# EAGLE design phaser (EAGLE 5.12)
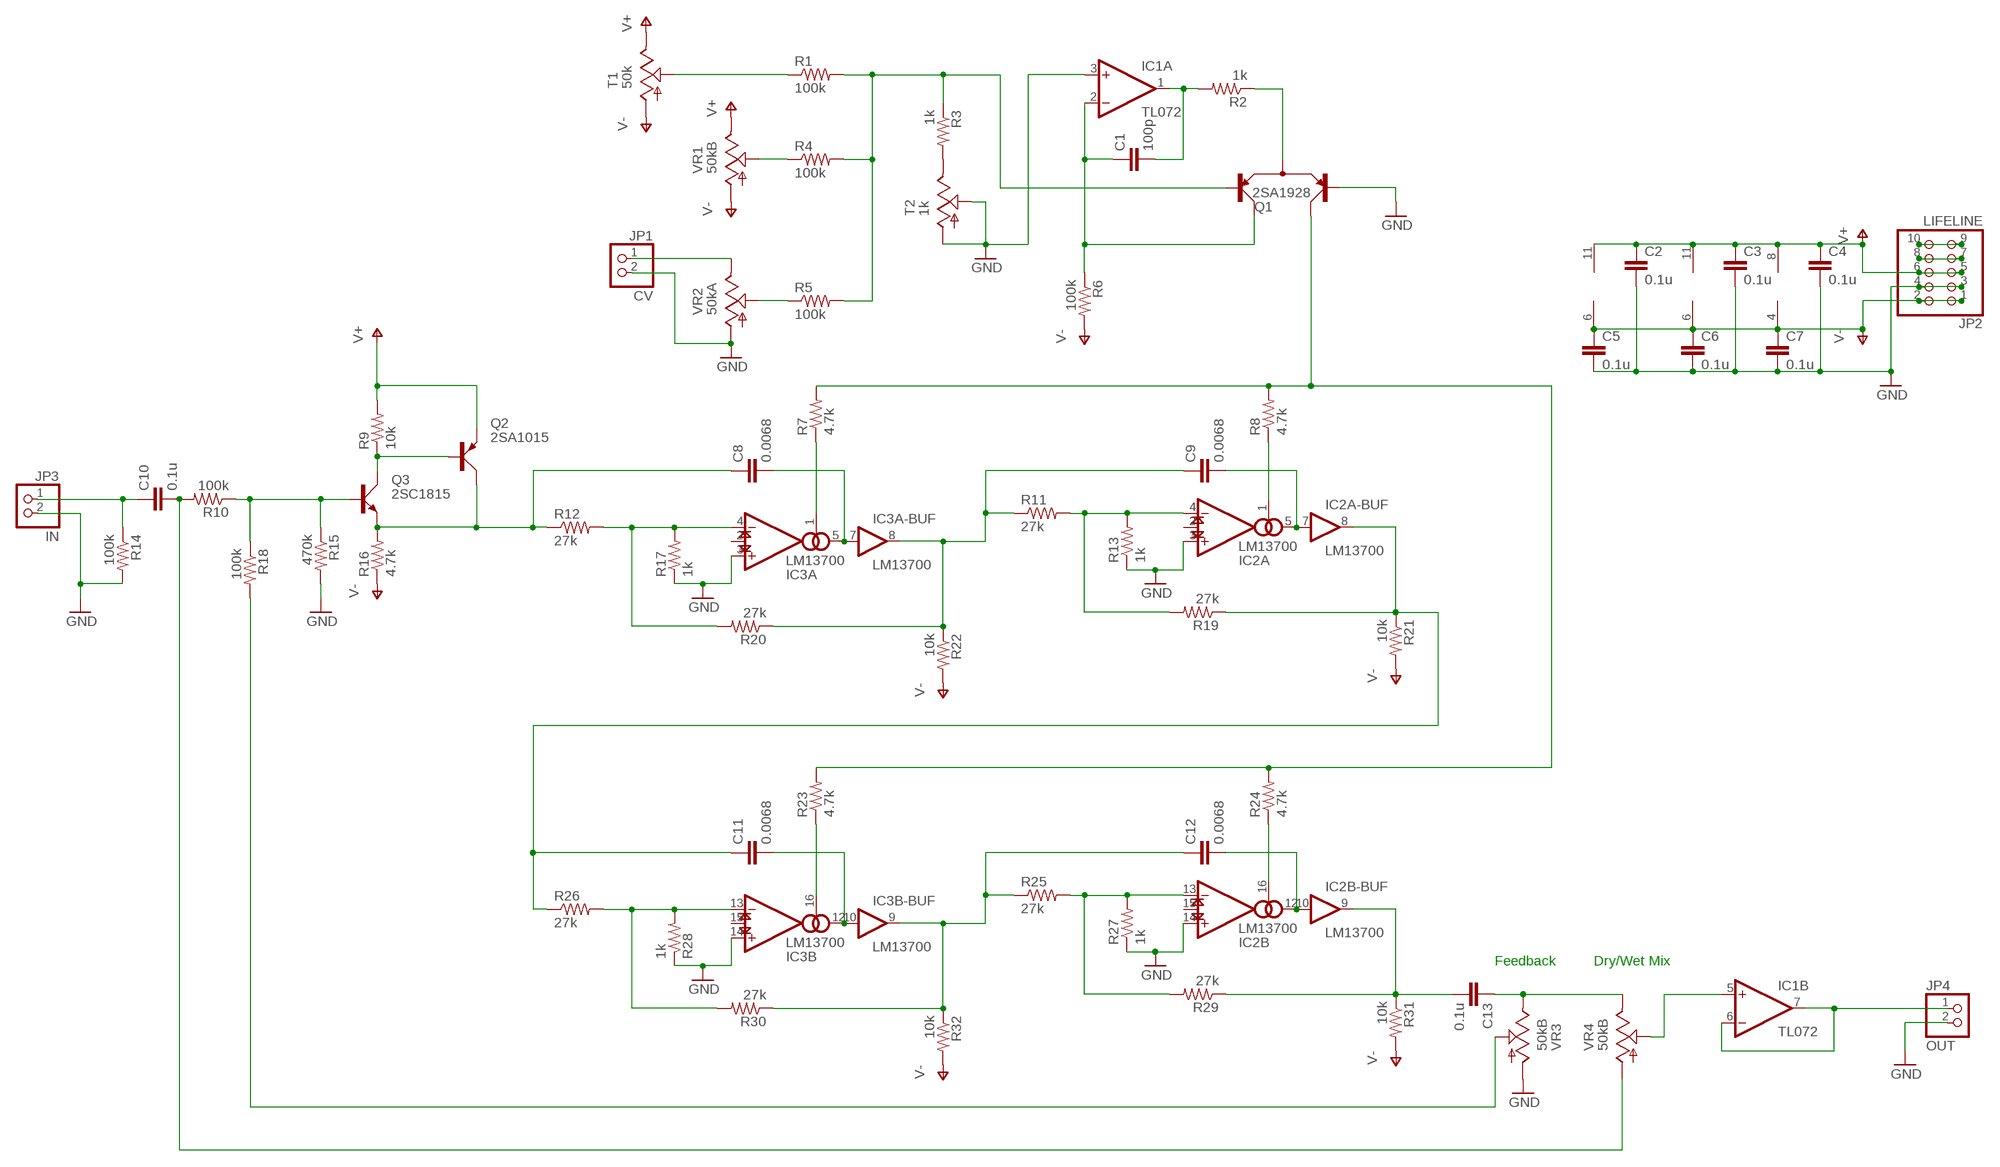
[diagram p0: schematic, sheet 1]

## Parts
C1  100p  C-EU025-025X050  [C025-025X050]
C2  0.1u  C-EU050-025X075  [C050-025X075]
C3  0.1u  C-EU050-025X075  [C050-025X075]
C4  0.1u  C-EU050-025X075  [C050-025X075]
C5  0.1u  C-EU050-025X075  [C050-025X075]
C6  0.1u  C-EU050-025X075  [C050-025X075]
C7  0.1u  C-EU050-025X075  [C050-025X075]
C8  0.0068  C-EU050-024X044  [C050-024X044]
C9  0.0068  C-EU050-024X044  [C050-024X044]
C10  0.1u  C-EU050-024X044  [C050-024X044]
C11  0.0068  C-EU050-024X044  [C050-024X044]
C12  0.0068  C-EU050-024X044  [C050-024X044]
C13  0.1u  C-EU050-024X044  [C050-024X044]
IC1  TL072  TL072P  [DIL08]
IC2  LM13700  LM13700R  [SO16FLIP]
IC3  LM13700  LM13700R  [SO16FLIP]
JP1  CV  PINHD-1X2  [1X02]
JP2  LIFELINE  PINHD-2X5  [2X05]
JP3  IN  PINHD-1X2  [1X02]
JP4  OUT  PINHD-1X2  [1X02]
Q1  2SA1928  [SIP5P]
Q2  2SA1015  [TO92-LINE]
Q3  2SC1815  2SC1815"  [TO92-LINE]
R1  100k  R-US_0204/5_SF  [0204/5_SF]
R2  1k  R-US_0204/5_SF  [0204/5_SF]
R3  1k  R-US_0204/5_SF  [0204/5_SF]
R4  100k  R-US_0204/5_SF  [0204/5_SF]
R5  100k  R-US_0204/5_SF  [0204/5_SF]
R6  100k  R-US_0204/5_SF  [0204/5_SF]
R7  4.7k  R-US_0204/5_SF  [0204/5_SF]
R8  4.7k  R-US_0204/5_SF  [0204/5_SF]
R9  10k  R-US_0204/5_SF  [0204/5_SF]
R10  100k  R-US_0204/5_SF  [0204/5_SF]
R11  27k  R-US_0204/5_SF  [0204/5_SF]
R12  27k  R-US_0204/5_SF  [0204/5_SF]
R13  1k  R-US_0204/5_SF  [0204/5_SF]
R14  100k  R-US_0204/5_SF  [0204/5_SF]
R15  470k  R-US_0204/5_SF  [0204/5_SF]
R16  4.7k  R-US_0204/5_SF  [0204/5_SF]
R17  1k  R-US_0204/5_SF  [0204/5_SF]
R18  100k  R-US_0204/5_SF  [0204/5_SF]
R19  27k  R-US_0204/5_SF  [0204/5_SF]
R20  27k  R-US_0204/5_SF  [0204/5_SF]
R21  10k  R-US_0204/5_SF  [0204/5_SF]
R22  10k  R-US_0204/5_SF  [0204/5_SF]
R23  4.7k  R-US_0204/5_SF  [0204/5_SF]
R24  4.7k  R-US_0204/5_SF  [0204/5_SF]
R25  27k  R-US_0204/5_SF  [0204/5_SF]
R26  27k  R-US_0204/5_SF  [0204/5_SF]
R27  1k  R-US_0204/5_SF  [0204/5_SF]
R28  1k  R-US_0204/5_SF  [0204/5_SF]
R29  27k  R-US_0204/5_SF  [0204/5_SF]
R30  27k  R-US_0204/5_SF  [0204/5_SF]
R31  10k  R-US_0204/5_SF  [0204/5_SF]
R32  10k  R-US_0204/5_SF  [0204/5_SF]
T1  50k  TRIM_US-B25P  [B25P]
T2  1k  TRIM_US-B25P  [B25P]
VR1  50kB  POT  [EVUE2]
VR2  50kA  POT  [EVUE2]
VR3  50kB  POT  [EVUE2]
VR4  50kB  POT  [EVUE2]

## Nets
GND: C2.2 C3.2 C4.2 C5.2 C6.2 C7.2 IC1.3(A:+IN) IC2.3(A:+IN) IC2.14(B:+IN) IC3.3(A:+IN) IC3.14(B:+IN) JP1.2 JP2.3 JP2.4 JP3.2 JP4.2 Q1.P$5(B2) R13.1 R14.2 R15.2 R17.1 R27.1 R28.1 T2.A T2.S VR2.A VR3.A
N$1: IC3.4(A:-IN) R12.2 R17.2 R20.2
N$2: IC2.4(A:-IN) R11.2 R13.2 R19.2
N$3: C9.1 IC3.8(A-BUF:OUT) R11.1 R20.1 R22.1
N$4: C8.2 IC3.5(A:OUT) IC3.7(A-BUF:IN)
N$5: Q2.1(B) Q3.2(C) R9.1
N$6: IC3.13(B:-IN) R26.2 R28.2 R30.2
N$7: C9.2 IC2.5(A:OUT) IC2.7(A-BUF:IN)
N$8: C12.1 IC3.9(B-BUF:OUT) R25.1 R30.1 R32.1
N$9: C11.2 IC3.10(B-BUF:IN) IC3.12(B:OUT)
N$10: Q1.P$4(C2) R7.2 R8.2 R23.2 R24.2
N$11: IC2.13(B:-IN) R25.2 R27.2 R29.2
N$12: C12.2 IC2.10(B-BUF:IN) IC2.12(B:OUT)
N$13: C13.2 IC2.9(B-BUF:OUT) R29.1 R31.1
N$14: IC3.1(A:IABC) R7.1
N$15: IC2.1(A:IABC) R8.1
N$16: IC3.16(B:IABC) R23.1
N$17: IC1.6(B:-IN) IC1.7(B:OUT) JP4.1
N$18: IC2.16(B:IABC) R24.1
N$19: R18.2 VR3.S
N$20: C8.1 Q2.2(C) Q3.3(E) R12.1 R16.2
N$21: R1.1 T1.S
N$22: C11.1 IC2.8(A-BUF:OUT) R19.1 R21.1 R26.1
N$23: C1.2 IC1.1(A:OUT) R2.2
N$24: Q1.P$3(E1) R2.1
N$25: C1.1 IC1.2(A:-IN) Q1.P$2(C1) R6.1
N$26: Q3.1(B) R10.1 R15.1 R18.1
N$27: Q1.P$1(B1) R1.2 R3.1 R4.2 R5.2
N$28: C10.2 R10.2 VR4.A
N$29: R3.2 T2.E
N$30: R5.1 VR2.S
N$31: R4.1 VR1.S
N$32: JP1.1 VR2.E
N$34: C13.1 VR3.E VR4.E
N$35: IC1.5(B:+IN) VR4.S
N$36: C10.1 JP3.1 R14.1
N$37: JP2.7 JP2.8
N$38: JP2.9 JP2.10
V+: C2.1 C3.1 C4.1 IC1.8(P:V+) IC2.11(V+) IC3.11(V+) JP2.5 JP2.6 Q2.3(E) R9.2 T1.E VR1.E
V-: C5.1 C6.1 C7.1 IC1.4(P:V-) IC2.6(V-) IC3.6(V-) JP2.1 JP2.2 R6.2 R16.1 R21.2 R22.2 R31.2 R32.2 T1.A VR1.A
Unconnected: IC2.2(A:DIODEBIAS) IC2.15(B:DIODEBIAS) IC3.2(A:DIODEBIAS) IC3.15(B:DIODEBIAS)

## Notes on the sheet
- Feedback | Dry/Wet Mix

## Library data of the parts
C1-C13 = akihabara:C-EU: CAPACITOR, European symbol
IC1 = linear:TL072: OP AMP
IC2 IC3 = akihabara:LM13700
JP1 JP3 JP4 = pinhead:PINHD-1X2: PIN HEADER
JP2 = pinhead:PINHD-2X5: PIN HEADER
Q1 = transistor-small-signal:2SA1928: 2SA1928 dual PNP transistor
Q2 = akihabara:2SA1015: 2SA1015 Complementary to 2SC1815. Package ECB
Q3 = akihabara:2SC1815: 2SC1815 Audio frequency general purpose amplifier. Package ECB. Complementary to 2SA1015
R1-R32 = akihabara:R-US_: RESISTOR, American symbol
T1 T2 = akihabara:TRIM_US-: POTENTIOMETER
VR1-VR4 = akihabara:POT

## Board
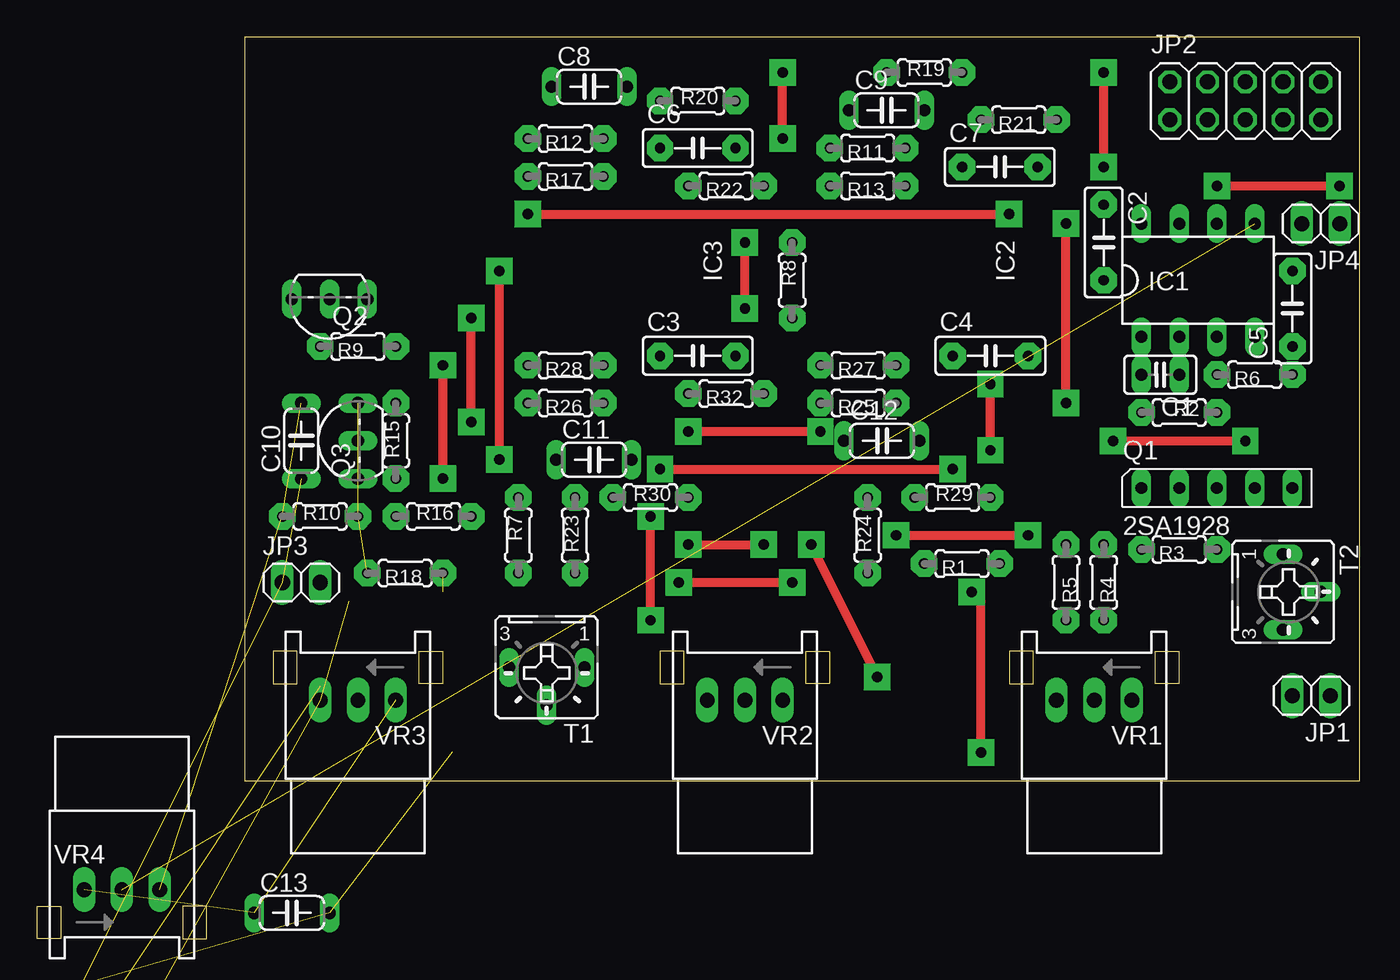
[diagram p1: board, top side]
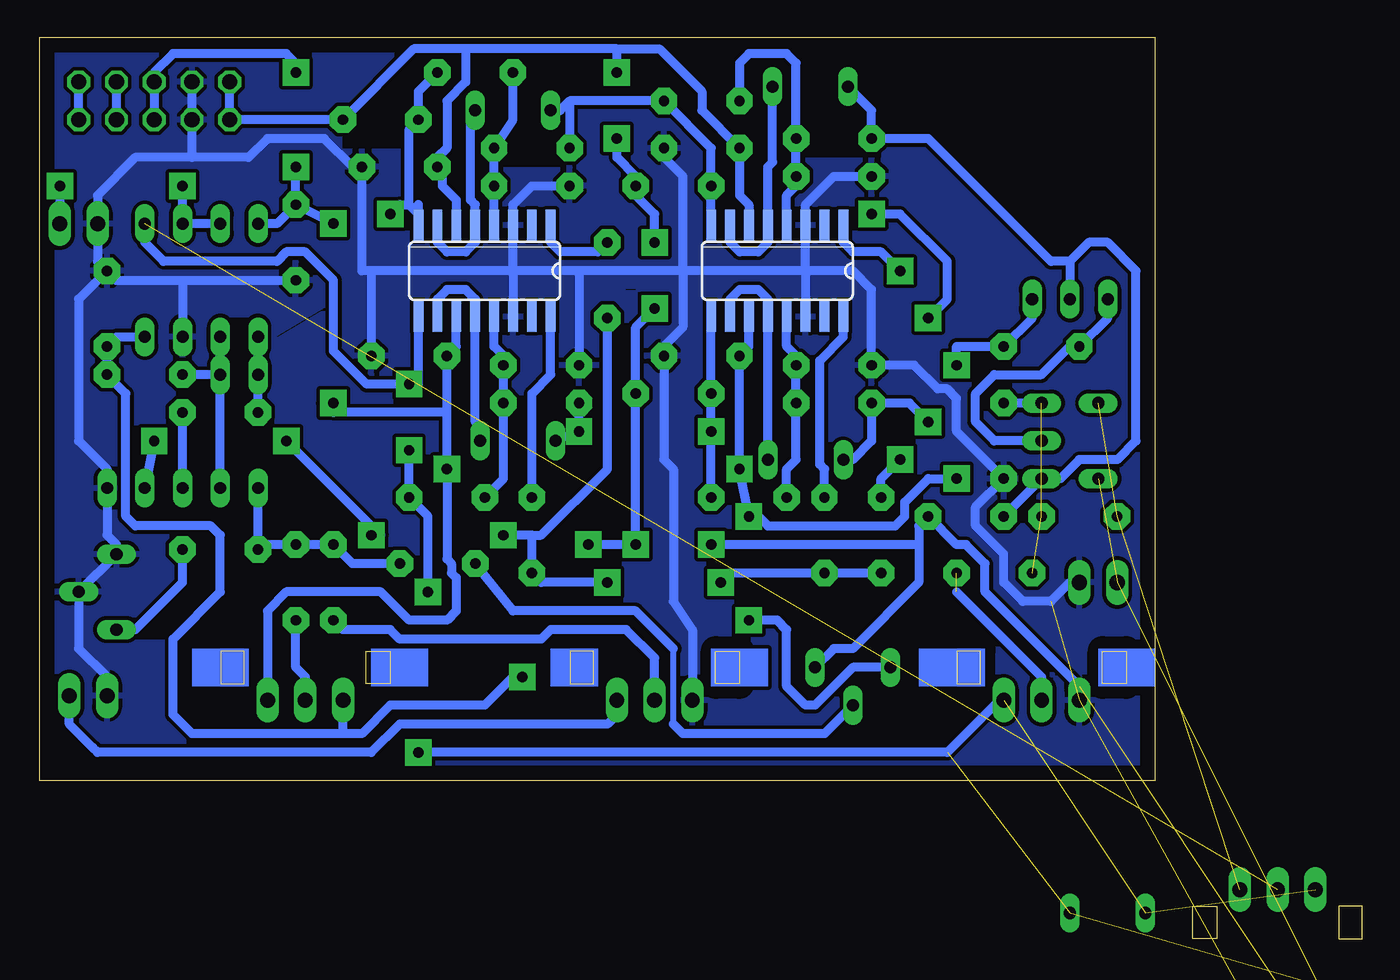
[diagram p2: board, bottom side, seen from below]

Size 75 x 50 mm. Coordinates in mm from the lower left corner, seen from the top.
Outline: 0,0 75,0 75,50 0,50 0,0
Copper layers (1*16): Top 0.035mm / dielectric 1.5mm / Bottom 0.035mm
Design rules "first": minimum track width 10mil, minimum drill 24mil, track to track 10mil, track to pad 10mil, pad to pad 10mil, via to via 10mil, smd to smd 8mil, copper to edge 40mil, drill to drill 16mil, minimum pad ring 10mil, minimum via ring 8mil, stop-mask expansion 4mil, vias tented up to drill 0mil, thermal gap 10mil
bRestrict: 8 lines

### Footprints (pad centres in the part's own frame; a part is rotated, then mirrored left to right if it is on the bottom)
C025-025X050 = drill 0.813 long: 1 -1.27,0; 2 1.27,0
C050-025X075 = drill 0.7 pad 1.778 octagon: 1 -2.54,0; 2 2.54,0
C050-024X044 = drill 0.813 long: 1 -2.54,0; 2 2.54,0
DIL08 = drill 0.813 long: 1 -3.81,-3.81; 2 -1.27,-3.81; 3 1.27,-3.81; 4 3.81,-3.81; 5 3.81,3.81; 6 1.27,3.81; 7 -1.27,3.81; 8 -3.81,3.81
SO16FLIP = smd 0.66 x 2.032 bottom: 1 4.445,-3.073; 2 3.175,-3.073; 3 1.905,-3.073; 4 0.635,-3.073; 5 -0.635,-3.073; 6 -1.905,-3.073; 7 -3.175,-3.073; 8 -4.445,-3.073; 9 -4.445,3.073; 10 -3.175,3.073; 11 -1.905,3.073; 12 -0.635,3.073; 13 0.635,3.073; 14 1.905,3.073; 15 3.175,3.073; 16 4.445,3.073
1X02 = drill 1.016 long: 1 -1.27,0; 2 1.27,0
2X05 = drill 1.016 octagon: 1 -5.08,-1.27; 2 -5.08,1.27; 3 -2.54,-1.27; 4 -2.54,1.27; 5 0,-1.27; 6 0,1.27; 7 2.54,-1.27; 8 2.54,1.27; 9 5.08,-1.27; 10 5.08,1.27
SIP5P = drill 0.8 long: P$1 -5.08,0; P$2 -2.54,0; P$3 0,0; P$4 2.54,0; P$5 5.08,0
TO92-LINE = drill 0.813 long: 1 2.54,0; 2 0,0; 3 -2.54,0
0204/5_SF = drill 0.7 pad 1.778 octagon: 1 -2.54,0; 2 2.54,0
B25P = drill 0.813 long: A -2.54,0; E 2.54,0; S 0,2.54
EVUE2 = drill 1 long: A 2.54,2.2; E -2.54,2.2; S 0,2.2

### Placement (x,y rotation side)
C1  61.59,27.3 180 top
C2  57.78,36.2 270 top
C3  30.48,28.57 0 top
C4  50.16,28.57 0 top
C5  70.48,31.75 90 top
C6  30.48,42.55 0 top
C7  50.8,41.27 0 top
C8  23.18,46.67 0 top
C9  43.18,45.09 0 top
C10  3.81,22.86 90 top
C11  23.5,21.59 0 top
C12  42.86,22.86 0 top
C13  3.17,-8.89 0 top  (outside the outline)
IC1  64.14,33.66 0 top
IC2  45.09,34.29 180 top
IC3  25.4,34.29 180 top
JP1  71.75,5.71 180 top
JP2  67.31,45.72 0 top
JP3  3.81,13.34 0 top
JP4  72.39,37.47 180 top
Q1  65.41,19.68 0 top
Q2  5.71,32.38 180 top
Q3  7.62,22.86 90 top
R1  48.26,14.61 0 top
R2  62.87,24.77 180 top
R3  62.87,15.56 0 top
R4  57.78,13.34 90 top
R5  55.24,13.34 90 top
R6  67.94,27.3 0 top
R7  18.41,16.51 270 top
R8  36.83,33.66 270 top
R9  7.62,29.21 0 top
R10  5.08,17.78 180 top
R11  41.91,42.55 0 top
R12  21.59,43.18 0 top
R13  41.91,40.01 0 top
R14  -11.43,-19.68 0 top  (outside the outline)
R15  10.16,22.86 270 top
R16  12.7,17.78 180 top
R17  21.59,40.64 0 top
R18  10.79,13.97 0 top
R19  45.72,47.62 180 top
R20  30.48,45.72 180 top
R21  52.07,44.45 0 top
R22  32.38,40.01 0 top
R23  22.23,16.51 270 top
R24  41.91,16.51 270 top
R25  41.27,25.4 0 top
R26  21.59,25.4 0 top
R27  41.27,27.94 0 top
R28  21.59,27.94 0 top
R29  47.62,19.05 180 top
R30  27.3,19.05 180 top
R31  -11.43,-14.61 0 top  (outside the outline)
R32  32.38,26.04 0 top
T1  20.32,7.62 180 top
T2  69.85,12.7 270 top
VR1  57.15,7.62 180 top
VR2  33.66,7.62 180 top
VR3  7.62,7.62 180 top
VR4  -8.26,-9.53 0 top  (outside the outline)

### Tracks (layer width: path | path; a pad name or v marks a point on that pad's centre or on a via)
GND  (2 unrouted)
  Bottom 0.61: 23.5,34.29 IC3.14 | 23.5,34.29 IC3.3 23.5,38.73 21.59,40.64 R17.1 | 23.5,34.29 31.75,34.29 | 31.75,34.29 38.73,34.29 | 38.73,34.29 43.18,34.29 | 43.18,34.29 52.7,34.29 | 52.7,34.29 53.34,34.29 C7.2 53.98,41.27 55.88,43.18 59.69,43.18 60.96,41.91 64.77,41.91 | 43.18,34.29 IC2.3 43.18,38.73 41.91,40.01 R13.1 | 43.18,34.29 IC2.14 | 52.7,34.29 C4.2 | 38.73,34.29 R27.1 | 31.75,34.29 31.75,30.48 33.02,29.21 C3.2 33.02,21.59 32.38,20.95 32.38,12.06 31.11,10.16 VR2.A | C6.2 33.02,41.91 31.75,40.64 31.75,34.29 | 64.77,41.91 JP2.3 JP2.4 | 64.77,41.91 68.58,41.91 71.12,39.37 JP4.2 71.12,34.92 C5.2 | 65.41,33.66 C2.2 | 65.41,33.66 69.85,33.66 C5.2 | 65.41,33.66 IC1.3 | JP1.2 70.48,6.99 72.39,8.89 T2.S T2.A 69.85,15.88 70.48,16.51 Q1.P$5 70.48,20.95 72.39,22.86 72.39,32.38 C5.2 | JP3.2 5.71,13.34 6.99,12.06 8.89,12.06 10.16,13.34 10.16,15.24 12.06,17.14 12.06,18.41 R15.2 13.34,23.5 13.34,25.72 13.97,26.35 14.61,26.35 16.19,27.94 R28.1 19.05,33.02 20.32,34.29 23.5,34.29
  pour Bottom: 0,50.16 75.56,50.16 75.56,-0.64 -0.64,-0.64 -0.64,50.16
N$1
  Bottom 0.61: IC3.4 24.77,39.37 24.13,40.01 R17.2 R12.2 24.13,48.26 24.77,48.9 27.3,48.9 27.94,48.26 R20.2
N$2
  Bottom 0.61: R19.2 43.18,44.45 R11.2 R13.2 IC2.4
N$3
  Bottom 0.61: IC3.8 R22.1 29.84,42.55 R20.1 39.37,45.72 | 39.37,45.72 R11.1 | 39.37,45.72 40.01,45.09 C9.1
N$4
  Bottom 0.61: 28.57,38.1 IC3.7 28.57,36.2 27.94,35.56 26.67,35.56 26.04,36.2 IC3.5 26.04,41.27 25.72,41.59 C8.2
N$5
  Bottom 0.61: Q2.1 3.17,31.11 R9.1 5.71,29.21 7.62,27.3 10.79,27.3 12.06,26.04 12.06,24.13 10.79,22.86 Q3.2
N$6
  Bottom 0.61: R30.2 24.77,20.95 24.13,21.59 R26.2 R28.2 24.13,28.57 24.77,29.21 IC3.13
N$7
  Bottom 0.61: IC2.7 48.26,36.2 47.62,35.56 46.35,35.56 45.72,36.2 IC2.5 45.72,38.73 46.04,39.05 46.04,44.77 C9.2
N$8  (via drill 0.7 pad 1.78)
  Top 0.61: v29.84,23.5 v38.73,23.5
  Bottom 0.61: R30.1 v29.84,23.5 R32.1 IC3.9 | C12.1 v38.73,23.5 R25.1
N$9
  Bottom 0.61: C11.2 IC3.12 26.04,32.38 26.67,33.02 27.94,33.02 28.57,32.38 IC3.10
N$10  (via drill 0.7 pad 1.78)
  Top 0.61: v43.81,16.51 v52.7,16.51 | v58.42,22.86 v67.31,22.86 | v29.21,13.34 v36.83,13.34
  Bottom 0.61: R7.2 R23.2 28.57,13.97 v29.21,13.34 | 41.91,16.51 R24.2 41.27,13.34 v36.83,13.34 | 41.91,16.51 v43.81,16.51 | v52.7,16.51 52.07,16.51 v58.42,22.86 | v67.31,22.86 Q1.P$4 | 41.91,16.51 41.27,16.51 36.83,20.95 R8.2
N$11
  Bottom 0.61: R29.2 43.81,20.32 R25.2 R27.2 43.81,28.57 44.45,29.21 IC2.13
N$12
  Bottom 0.61: C12.2 45.4,23.81 45.72,24.13 IC2.12 45.72,32.38 46.35,33.02 47.62,33.02 48.26,32.38 IC2.10
N$13  (via drill 0.7 pad 1.78)  (2 unrouted)
  Top 0.61: v50.16,22.23 v50.16,26.67 | v49.53,1.91 49.53,12.06 v48.9,12.7
  Bottom 0.61: 67.94,36.2 66.67,34.92 59.05,34.92 58.42,35.56 57.15,35.56 55.24,33.66 55.24,28.89 53.02,26.67 v50.16,26.67 49.53,26.67 IC2.9 | v50.16,22.23 R29.1 48.9,17.78 v48.9,12.7 | 10.46,5.42 13.97,1.91 v49.53,1.91
N$14  (via drill 0.7 pad 1.78)
  Top 0.61: v17.14,21.59 v17.14,34.29
  Bottom 0.61: R7.1 18.41,20.32 v17.14,21.59 | v17.14,34.29 18.41,35.56 20.32,35.56 20.95,36.2 IC3.1
N$15
  Bottom 0.61: R8.1 37.47,35.56 40.01,35.56 40.64,36.2 IC2.1
N$16
  Bottom 0.61: R23.1 22.23,20.95 22.54,21.27 22.54,28.26 20.95,29.84 IC3.16
N$17  (via drill 0.7 pad 1.78)
  Top 0.61: v65.41,40.01 v73.66,40.01
  Bottom 0.61: IC1.7 IC1.6 v65.41,40.01 | v73.66,40.01 JP4.1
N$18
  Bottom 0.61: R24.1 41.91,26.04 40.64,27.3 IC2.16
N$19  (1 unrouted)
  Bottom 0.61: VR3.S 7.62,6.99 13.34,12.7
N$20
  Bottom 0.61: R16.2 Q3.3 6.35,20.32 5.08,21.59 2.54,21.59 1.27,22.86 1.27,34.29 3.17,36.2 4.45,36.2 5.71,34.92 | 5.71,34.92 Q2.2 | 5.71,34.92 6.99,34.92 15.24,43.18 R12.1 19.05,45.09 C8.1
N$21
  Bottom 0.406: 32.38,3.81 32.38,8.89
  Bottom 0.61: R1.1 43.18,11.43 34.92,11.43 32.38,8.89 | 32.38,3.81 31.75,3.17 22.23,3.17 T1.S
N$22  (via drill 0.7 pad 1.78)
  Top 0.61: v19.05,38.1 v51.44,38.1 | v15.24,24.13 v15.24,31.11
  Bottom 0.61: R19.1 49.53,46.35 R21.1 50.16,43.81 50.16,38.73 | 49.53,38.73 IC2.8 49.53,38.1 50.16,38.73 | C11.1 20.32,21.59 19.05,22.86 R26.1 16.51,25.4 v15.24,24.13 | 50.16,38.73 50.8,38.73 v51.44,38.1 | v19.05,38.1 17.14,38.1 13.97,34.92 13.97,32.38 v15.24,31.11
N$23
  Bottom 0.61: IC1.1 C1.2 R2.2
N$24
  Bottom 0.61: Q1.P$3 R2.1
N$25
  Bottom 0.61: Q1.P$2 C1.1 | C1.1 IC1.2 | C1.1 R6.1
N$26  (2 unrouted)
  Bottom 0.61: Q3.1 R15.1
N$27
  Bottom 0.61: Q1.P$1 R3.1 60.01,15.88 R4.2 R5.2 53.98,14.61 R1.2
N$28  (2 unrouted)
N$29
  Bottom 0.61: R3.2 65.41,13.34 68.58,10.16 T2.E
N$30
  Bottom 0.61: R5.1 54.61,10.16 51.44,10.16 50.8,9.53 41.27,9.53 40.64,10.16 35.56,10.16 33.66,8.26 VR2.S
N$31
  Bottom 0.61: VR1.S 57.15,6.99 57.78,7.62 R4.1
N$32
  Bottom 0.61: JP1.1 73.03,3.81 71.44,2.22 71.12,1.91 52.7,1.91 50.8,3.81 36.83,3.81 36.2,4.45 VR2.E
N$34  (2 unrouted)
N$35  (1 unrouted)
N$36  (2 unrouted)
N$37
  Bottom 0.61: JP2.7 JP2.8
N$38
  Bottom 0.61: JP2.9 JP2.10
V+  (via drill 0.7 pad 1.78)
  Top 0.61: v57.78,41.27 v57.78,47.62 | v55.24,25.4 v55.24,37.47 | v27.94,20.95 v47.62,20.95 | v27.3,10.79 v27.3,17.78 | v13.34,20.32 v13.34,27.94
  Bottom 0.61: JP2.5 JP2.6 67.31,47.62 66.04,48.9 58.42,48.9 57.78,48.26 v57.78,47.62 | C2.1 v57.78,41.27 | C2.1 59.05,37.47 IC1.8 | v55.24,37.47 C2.1 | v55.24,25.4 55.88,25.4 55.24,24.77 47.62,24.77 | 47.62,24.77 C4.1 46.99,29.21 IC2.11 | IC3.11 27.3,29.21 C3.1 v27.94,20.95 v27.3,17.78 26.67,17.78 26.04,17.14 17.46,17.14 16.83,17.78 16.83,18.73 15.24,20.32 v13.34,20.32 | 47.62,24.77 v47.62,20.95 47.62,14.92 47.31,14.61 47.31,13.97 46.99,13.65 46.99,11.43 47.62,10.79 50.16,10.79 52.07,12.7 58.42,12.7 59.69,11.43 VR1.E | T1.E 20.32,7.62 22.86,5.08 23.5,5.08 24.77,6.35 24.77,10.16 25.4,10.79 v27.3,10.79 | Q2.3 8.26,31.11 R9.2 13.34,29.21 v13.34,27.94
V-  (via drill 0.7 pad 1.78)  (1 unrouted)
  Top 0.61: v33.66,31.75 v33.66,36.2 | v36.2,43.18 v36.2,47.62 | v38.1,15.88 v42.55,6.99 | v29.84,15.88 v34.92,15.88
  Bottom 0.61: IC3.6 27.3,38.73 27.94,39.37 C6.1 30.48,45.09 30.48,46.35 33.34,49.21 36.2,49.21 | v33.66,36.2 33.66,38.1 34.92,39.37 R22.2 34.92,40.64 36.2,41.91 v36.2,43.18 | v33.66,31.75 34.92,30.48 R32.2 v34.92,15.88 v38.1,15.88 | v36.2,47.62 36.2,49.21 | 36.2,49.21 46.35,49.21 | 46.35,49.21 49.85,49.21 R21.2 JP2.1 JP2.2 | 46.35,49.21 46.35,46.99 47.62,45.72 47.62,42.55 48.26,41.91 C7.1 47.94,40.96 47.94,40.01 46.99,39.05 IC2.6 | 54.61,3.17 VR1.A | 54.61,3.17 64.77,3.17 66.04,4.45 66.04,9.53 62.87,12.7 62.87,16.51 63.5,17.14 68.58,17.14 69.22,17.78 69.22,26.04 R6.2 C5.1 69.85,29.84 IC1.4 | 54.61,3.17 53.34,3.17 51.44,5.08 45.09,5.08 43.18,6.99 v42.55,6.99 | T1.A 21.59,8.89 20.32,8.89 15.88,13.34 15.88,15.88 | 15.88,15.88 v29.84,15.88 | 15.88,15.88 15.88,17.14 R16.1 13.34,15.88 12.7,15.88 11.43,14.61 11.43,12.7 5.08,6.35
(copper drawn outside any net)
  shapes: Bottom area x6